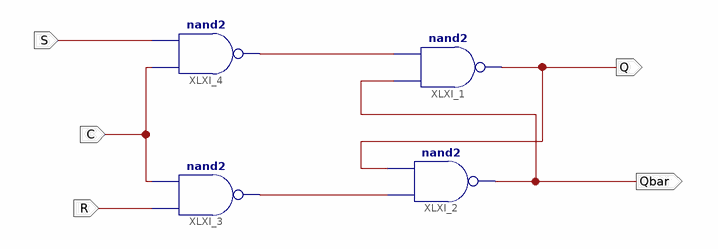
[diagram p0: schematic sheet 1]
// Xilinx ISE schematic CSR_LATCH.sch (kintex7) as structural Verilog: 4 symbols, 5 ports
module CSR_LATCH (
  input  R,
  input  S,
  input  C,
  output Qbar,
  output Q
);

  wire XLXN_6, XLXN_7;

  nand XLXI_1 (Q, Qbar, XLXN_6);
  nand XLXI_2 (Qbar, XLXN_7, Q);
  nand XLXI_3 (XLXN_7, R, C);
  nand XLXI_4 (XLXN_6, C, S);
endmodule
